# EasyEDA schematic s2_sch.json
TITLE: Relay Board ESP8266; REV: 1.0; Date: 2018-06-06; Sheet: 1/1; Drawn By: CobaltDragon
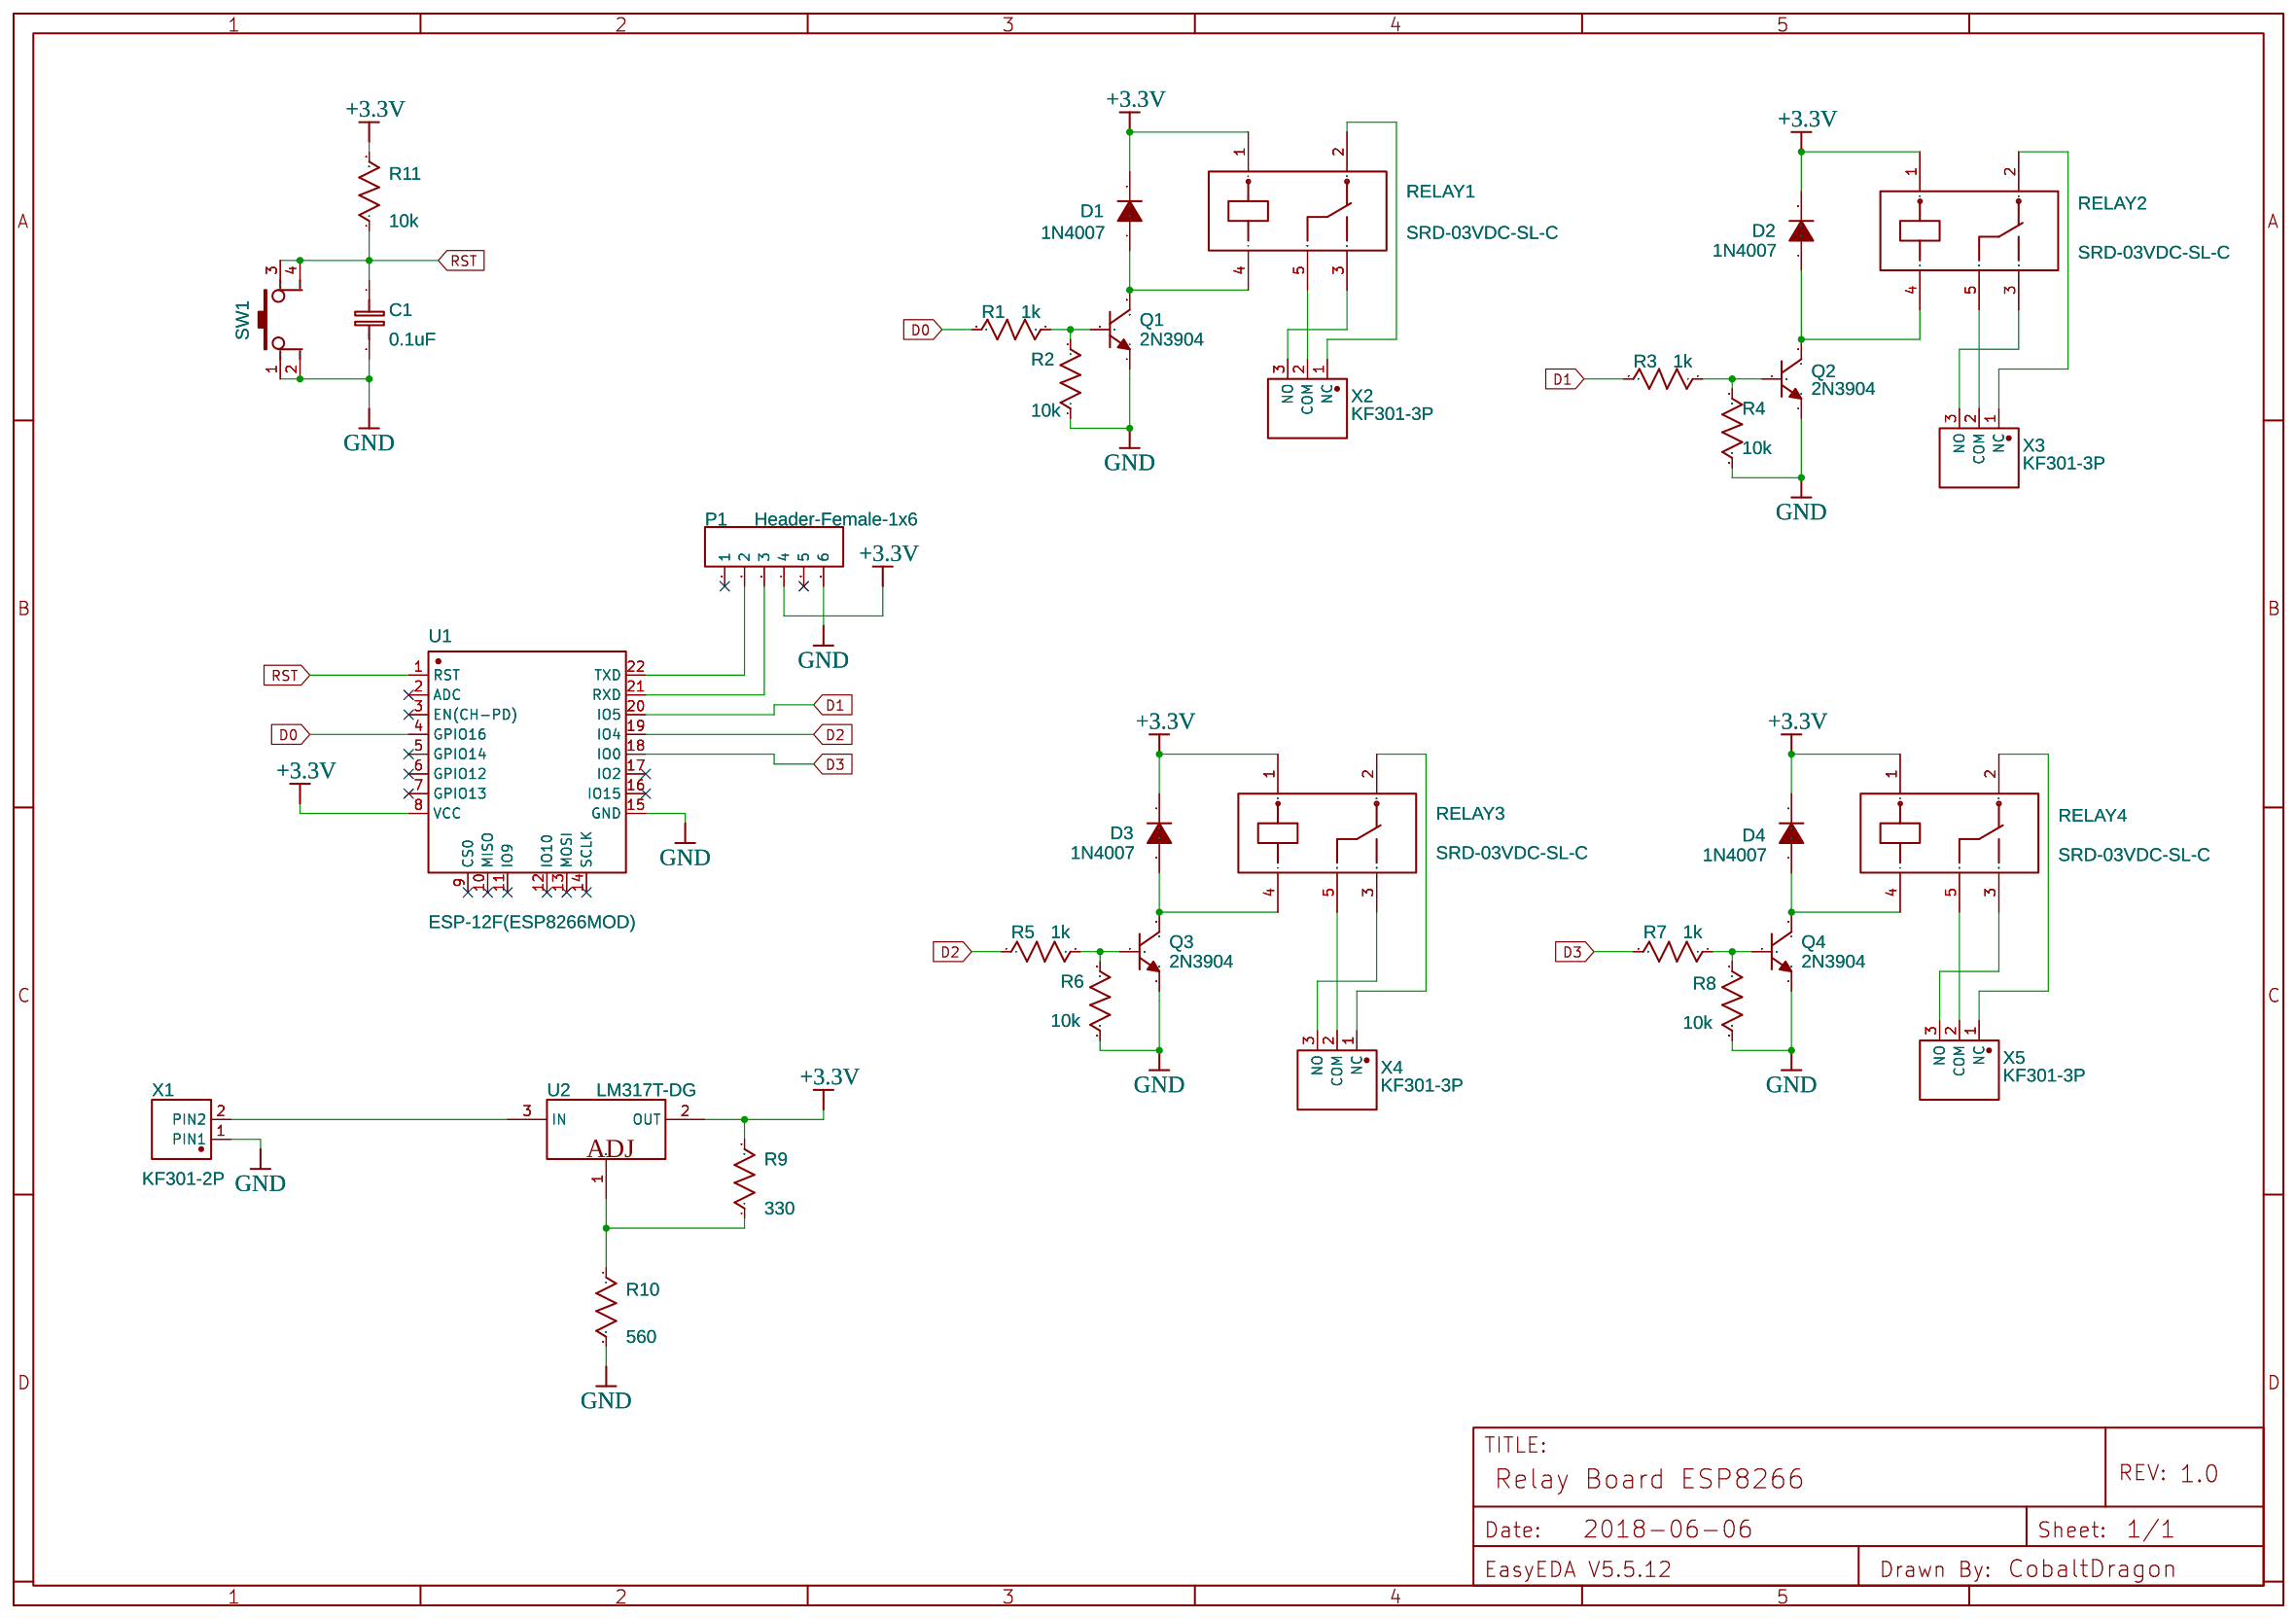
[diagram p0: schematic sheet]

## Parts
C1  0.1uF  [RAD-0.1]
D1  1N4007  [DO-41]
D2  1N4007  [DO-41]
D3  1N4007  [DO-41]
D4  1N4007  [DO-41]
P1  Header-Female-1x6  [HDR-6X1/2.54]
Q1  2N3904  [TO-92(TO-92-3)]
Q2  2N3904  [TO-92(TO-92-3)]
Q3  2N3904  [TO-92(TO-92-3)]
Q4  2N3904  [TO-92(TO-92-3)]
R1  1k  [AXIAL-0.3]
R2  10k  [AXIAL-0.3]
R3  1k  [AXIAL-0.3]
R4  10k  [AXIAL-0.3]
R5  1k  [AXIAL-0.3]
R6  10k  [AXIAL-0.3]
R7  1k  [AXIAL-0.3]
R8  10k  [AXIAL-0.3]
R9  330  [AXIAL-0.3]
R10  560  [AXIAL-0.3]
R11  10k  [AXIAL-0.3]
RELAY1  SRD-03VDC-SL-C  [RELAY-SL-SRD]
RELAY2  SRD-03VDC-SL-C  [RELAY-SL-SRD]
RELAY3  SRD-03VDC-SL-C  [RELAY-SL-SRD]
RELAY4  SRD-03VDC-SL-C  [RELAY-SL-SRD]
SW1  SWITCH,4.5*4.5*3.8PLASTIC HEAD,260G, 0.25MM,STRAIGHT LINE  [KEY-4.5*4.5-2]
U1  ESP-12F(ESP8266MOD)  [ESP-12F(ESP8266MOD)]
U2  LM317T-DG  [TO-220(TO-220-3)]
X1  KF301-2P  [KF301-2P]
X2  KF301-3P  [KF301-3P]
X3  KF301-3P  [KF301-3P]
X4  KF301-3P  [KF301-3P]
X5  KF301-3P  [KF301-3P]

## Library data of the parts
C1 = Capacitor: Manufacturer Part: ?
D1-D4 = -: Supplier: LCSC; Manufacturer: LRC; image: //image.lceda.cn/szlcsc/C78540.jpg; Supplier Part: C78540
P1 = -: Supplier: LCSC; Manufacturer: BOOMELE; Manufacturer Part: Female header 1*6p; Supplier Part: C40877
Q1-Q4 = -: Supplier: LCSC; Manufacturer: SEMTECH; Supplier Part: C118538
R1-R11 = Res_AXIAL-0.3(1/8W)_US: Manufacturer Part: ?
RELAY1-RELAY4 = -: Supplier: LCSC; Manufacturer: SONGLE; Supplier Part: C24585
SW1 = -: Supplier: LCSC; Manufacturer: BBJ; Manufacturer Part: Switch,4.5*4.5*3.8Plastic head,260G, 0.25mm,Straight line; Contributor: LCSC; Supplier Part: C71853
U1 = -: Supplier: LCSC; Manufacturer: Ai-Thinker; Supplier Part: C82891
U2 = -: Supplier: LCSC; Manufacturer: STMicroelectronics; image: //image.lceda.cn/szlcsc/C18718.jpg; Supplier Part: C18718
X1-X5 = -: Contributor: Арчи Непирожков

## Nets
+3.3V: D1.2(K) D2.2(K) D3.2(K) D4.2(K) P1.4 R9.2 R11.2 RELAY1.1 RELAY2.1 RELAY3.1 RELAY4.1 U1.8(VCC) U2.2(OUT)
GND: C1.2 P1.6 Q1.1(E) Q2.1(E) Q3.1(E) Q4.1(E) R2.1 R4.2 R6.1 R8.2 R10.2 SW1.1 SW1.2 U1.15(GND) X1.1(PIN1)
D0: R1.1 U1.4(GPIO16)
D1: R3.2 U1.20(IO5)
D2: R5.1 U1.19(IO4)
D3: R7.2 U1.18(IO0)
RST: C1.1 R11.1 SW1.3 SW1.4 U1.1(RST)
Net-(D1-1): D1.1(A) Q1.3(C) RELAY1.4
Net-(D2-1): D2.1(A) Q2.3(C) RELAY2.4
Net-(D3-1): D3.1(A) Q3.3(C) RELAY3.4
Net-(D4-1): D4.1(A) Q4.3(C) RELAY4.4
Net-(P1-2): P1.2 U1.22(TXD)
Net-(P1-3): P1.3 U1.21(RXD)
Net-(Q1-2): Q1.2(B) R1.2 R2.2
Net-(Q2-2): Q2.2(B) R3.1 R4.1
Net-(Q3-2): Q3.2(B) R5.2 R6.2
Net-(Q4-2): Q4.2(B) R7.1 R8.1
Net-(R9-1): R9.1 R10.1 U2.1(ADJ)
Net-(RELAY1-2): RELAY1.2 X2.1(NC)
Net-(RELAY1-3): RELAY1.3 X2.3(NO)
Net-(RELAY1-5): RELAY1.5 X2.2(COM)
Net-(RELAY2-2): RELAY2.2 X3.1(NC)
Net-(RELAY2-3): RELAY2.3 X3.3(NO)
Net-(RELAY2-5): RELAY2.5 X3.2(COM)
Net-(RELAY3-2): RELAY3.2 X4.1(NC)
Net-(RELAY3-3): RELAY3.3 X4.3(NO)
Net-(RELAY3-5): RELAY3.5 X4.2(COM)
Net-(RELAY4-2): RELAY4.2 X5.1(NC)
Net-(RELAY4-3): RELAY4.3 X5.3(NO)
Net-(RELAY4-5): RELAY4.5 X5.2(COM)
Net-(U2-3): U2.3(IN) X1.2(PIN2)

Not connected (* = marked no-connect by the designer): P1 1* 5*; U1 2(ADC)* 3(EN(CH-PD))* 5(GPIO14)* 6(GPIO12)* 7(GPIO13)* 9(CS0)* 10(MISO)* 11(IO9)* 12(IO10)* 13(MOSI)* 14(SCLK)* 16(IO15)* 17(IO2)*
